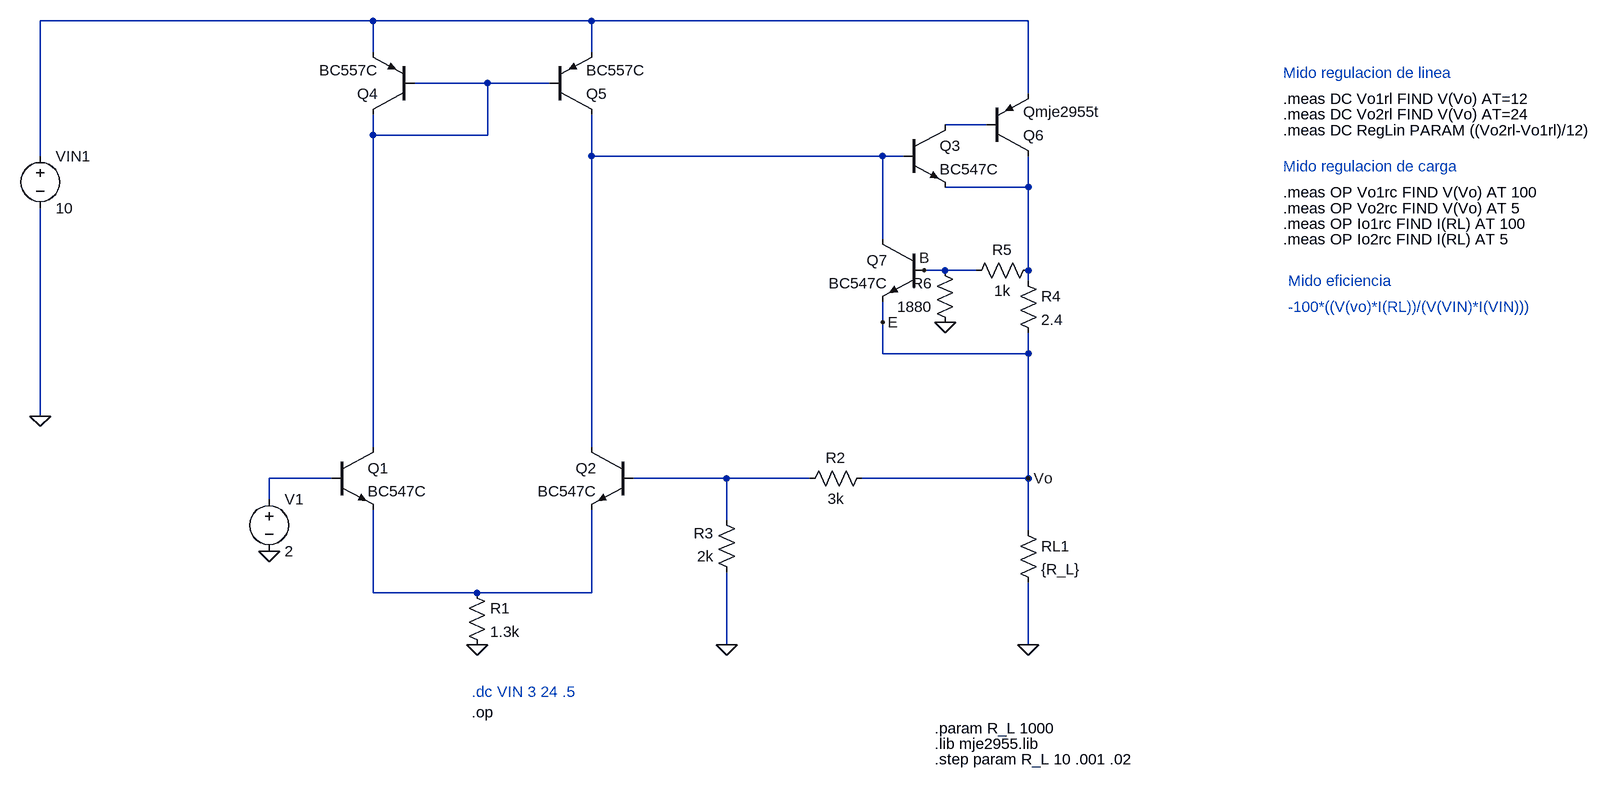
[diagram p0: schematic primer_check_4.asc]
primer_check_4.asc, the LTspice schematic file:
Version 4.1
SHEET 1 1772 680
WIRE -144 -1248 -656 -1248
WIRE 192 -1248 -144 -1248
WIRE 864 -1248 192 -1248
WIRE -144 -1200 -144 -1248
WIRE 192 -1200 192 -1248
WIRE 32 -1152 -80 -1152
WIRE 128 -1152 32 -1152
WIRE 864 -1136 864 -1248
WIRE 800 -1088 736 -1088
WIRE -144 -1072 -144 -1104
WIRE 32 -1072 32 -1152
WIRE 32 -1072 -144 -1072
WIRE -656 -1040 -656 -1248
WIRE 192 -1040 192 -1104
WIRE 640 -1040 192 -1040
WIRE 672 -1040 640 -1040
WIRE 864 -992 864 -1040
WIRE 864 -992 736 -992
WIRE 640 -912 640 -1040
WIRE 736 -864 704 -864
WIRE 784 -864 736 -864
WIRE 864 -864 864 -992
WIRE 864 -848 864 -864
WIRE 640 -784 640 -816
WIRE 640 -736 640 -784
WIRE 864 -736 864 -768
WIRE 864 -736 640 -736
WIRE -656 -640 -656 -960
WIRE -144 -592 -144 -1072
WIRE 192 -592 192 -1040
WIRE -208 -544 -304 -544
WIRE 400 -544 256 -544
WIRE 528 -544 400 -544
WIRE 864 -544 864 -736
WIRE 864 -544 608 -544
WIRE -304 -512 -304 -544
WIRE 400 -480 400 -544
WIRE 864 -464 864 -544
WIRE -144 -368 -144 -496
WIRE 16 -368 -144 -368
WIRE 192 -368 192 -496
WIRE 192 -368 16 -368
WIRE 400 -288 400 -400
WIRE 864 -288 864 -384
FLAG -304 -432 0
FLAG 16 -288 0
FLAG 864 -288 0
FLAG -656 -640 0
FLAG 400 -288 0
FLAG 864 -544 Vo
FLAG 736 -784 0
FLAG 704 -864 B
FLAG 640 -784 E
SYMBOL npn -208 -592 R0
SYMATTR InstName Q1
SYMATTR Value BC547C
SYMBOL npn 256 -592 M0
SYMATTR InstName Q2
SYMATTR Value BC547C
SYMBOL npn 672 -1088 R0
SYMATTR InstName Q3
SYMATTR Value BC547C
SYMBOL pnp -80 -1104 R180
SYMATTR InstName Q4
SYMATTR Value BC557C
SYMBOL pnp 128 -1104 M180
SYMATTR InstName Q5
SYMATTR Value BC557C
SYMBOL res 0 -384 R0
SYMATTR InstName R1
SYMATTR Value 1.3k
SYMBOL voltage -304 -528 R0
WINDOW 123 0 0 Left 0
WINDOW 39 0 0 Left 0
SYMATTR InstName V1
SYMATTR Value 2
SYMBOL voltage -656 -1056 R0
WINDOW 123 0 0 Left 0
WINDOW 39 0 0 Left 0
SYMATTR InstName VIN1
SYMATTR Value 10
SYMBOL pnp 800 -1040 M180
SYMATTR InstName Q6
SYMATTR Value Qmje2955t
SYMBOL res 848 -480 R0
SYMATTR InstName RL1
SYMATTR Value {R_L}
SYMBOL res 624 -560 R90
WINDOW 0 0 56 VBottom 2
WINDOW 3 32 56 VTop 2
SYMATTR InstName R2
SYMATTR Value 3k
SYMBOL res 416 -384 R180
WINDOW 0 36 76 Left 2
WINDOW 3 36 40 Left 2
SYMATTR InstName R3
SYMATTR Value 2k
SYMBOL npn 704 -912 M0
SYMATTR InstName Q7
SYMATTR Value BC547C
SYMBOL res 848 -864 R0
SYMATTR InstName R4
SYMATTR Value 2.4
SYMBOL res 880 -880 R90
WINDOW 0 0 56 VBottom 2
WINDOW 3 32 56 VTop 2
SYMATTR InstName R5
SYMATTR Value 1k
SYMBOL res 752 -768 R180
WINDOW 0 36 76 Left 2
WINDOW 3 36 40 Left 2
SYMATTR InstName R6
SYMATTR Value 1880
TEXT 720 -160 Left 2 !.param R_L 1000
TEXT 720 -136 Left 2 !.lib mje2955.lib
TEXT 8 -216 Left 2 ;.dc VIN 3 24 .5
TEXT 720 -112 Left 2 !.step param R_L 10 .001 .02
TEXT 8 -184 Left 2 !.op
TEXT 1256 -1168 Left 2 ;Mido regulacion de linea
TEXT 1256 -1128 Left 2 !.meas DC Vo1rl FIND V(Vo) AT=12
TEXT 1256 -1104 Left 2 !.meas DC Vo2rl FIND V(Vo) AT=24
TEXT 1256 -1080 Left 2 !.meas DC RegLin PARAM ((Vo2rl-Vo1rl)/12)
TEXT 1256 -1024 Left 2 ;Mido regulacion de carga
TEXT 1256 -984 Left 2 !.meas OP Vo1rc FIND V(Vo) AT 100
TEXT 1256 -960 Left 2 !.meas OP Vo2rc FIND V(Vo) AT 5
TEXT 1256 -936 Left 2 !.meas OP Io1rc FIND I(RL) AT 100
TEXT 1256 -912 Left 2 !.meas OP Io2rc FIND I(RL) AT 5
TEXT 1264 -848 Left 2 ;Mido eficiencia
TEXT 1264 -808 Left 2 ;-100*((V(vo)*I(RL))/(V(VIN)*I(VIN)))

The netlist it stands for:
* primer_check_4.asc
Q1 N002 N006 N008 0 BC547C
Q2 N004 N007 N008 0 BC547C
Q3 N003 N004 N005 0 BC547C
Q4 N002 N002 N001 0 BC557C
Q5 N004 N002 N001 0 BC557C
R1 N008 0 1.3k
V1 N006 0 2
VIN1 N001 0 10
Q6 N005 N003 N001 0 Qmje2955t
RL1 E 0 {R_L}
R2 E N007 3k
R3 0 N007 2k
Q7 N004 B E 0 BC547C
R4 N005 E 2.4
R5 N005 B 1k
R6 0 B 1880
.model NPN NPN
.model PNP PNP
.lib standard.bjt
.param R_L 1000
.lib mje2955.lib
* .dc VIN 3 24 .5
.step param R_L 10 .001 .02
.op
* Mido regulacion de linea
.meas DC Vo1rl FIND V(Vo) AT=12
.meas DC Vo2rl FIND V(Vo) AT=24
.meas DC RegLin PARAM ((Vo2rl-Vo1rl)/12)
* Mido regulacion de carga
.meas OP Vo1rc FIND V(Vo) AT 100
.meas OP Vo2rc FIND V(Vo) AT 5
.meas OP Io1rc FIND I(RL) AT 100
.meas OP Io2rc FIND I(RL) AT 5
* Mido eficiencia
* -100*((V(vo)*I(RL))/(V(VIN)*I(VIN)))
.backanno
.end